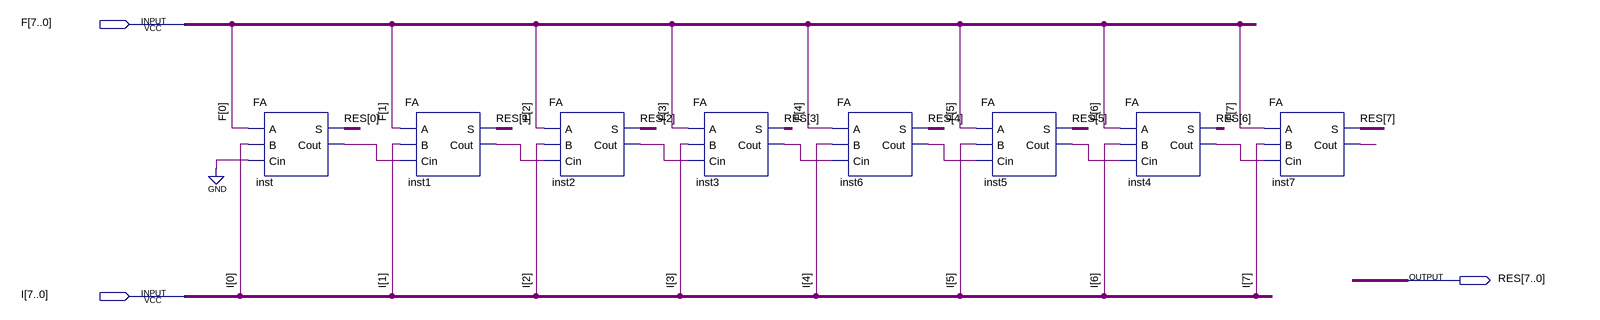
[diagram p0: schematic sheet]
// Quartus schematic Adder8bits.bdf as structural Verilog: 8 symbols, 3 pins
module Adder8bits (
  input  [7:0] F,
  input  [7:0] I,
  output [7:0] RES
);

  wire inst1_cout, inst2_cout, inst3_cout, inst4_cout, inst5_cout, inst6_cout, inst7_cout, inst_cout;

  FA inst (.A(F[0]), .B(I[0]), .Cin(1'b0), .S(RES[0]), .Cout(inst_cout));
  FA inst1 (.A(F[1]), .B(I[1]), .Cin(inst_cout), .S(RES[1]), .Cout(inst1_cout));
  FA inst2 (.A(F[2]), .B(I[2]), .Cin(inst1_cout), .S(RES[2]), .Cout(inst2_cout));
  FA inst3 (.A(F[3]), .B(I[3]), .Cin(inst2_cout), .S(RES[3]), .Cout(inst3_cout));
  FA inst6 (.A(F[4]), .B(I[4]), .Cin(inst3_cout), .S(RES[4]), .Cout(inst6_cout));
  FA inst5 (.A(F[5]), .B(I[5]), .Cin(inst6_cout), .S(RES[5]), .Cout(inst5_cout));
  FA inst4 (.A(F[6]), .B(I[6]), .Cin(inst5_cout), .S(RES[6]), .Cout(inst4_cout));
  FA inst7 (.A(F[7]), .B(I[7]), .Cin(inst4_cout), .S(RES[7]), .Cout(inst7_cout));
endmodule
